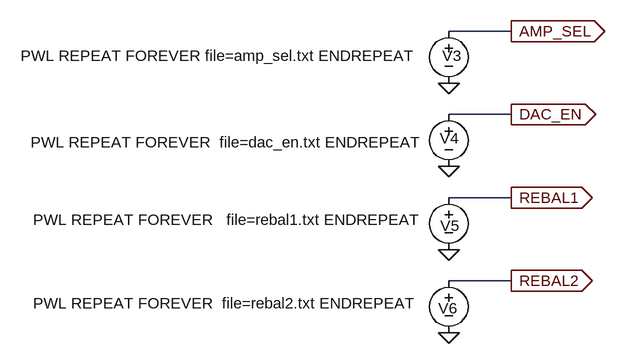
[diagram p0: schematic Python_Signal_Generator.asc]
Python_Signal_Generator.asc, the LTspice schematic file:
Version 4
SHEET 1 880 996
WIRE 176 256 80 256
WIRE 176 384 80 384
WIRE 176 512 80 512
WIRE 176 640 80 640
FLAG 80 336 0
FLAG 176 256 AMP_SEL
IOPIN 176 256 Out
FLAG 176 384 DAC_EN
IOPIN 176 384 Out
FLAG 176 512 REBAL1
IOPIN 176 512 Out
FLAG 176 640 REBAL2
IOPIN 176 640 Out
FLAG 80 464 0
FLAG 80 592 0
FLAG 80 720 0
SYMBOL voltage 80 240 R0
WINDOW 0 -10 54 Left 2
WINDOW 3 -659 54 Left 2
SYMATTR InstName V3
SYMATTR Value PWL REPEAT FOREVER file=amp_sel.txt ENDREPEAT
SYMBOL voltage 80 368 R0
WINDOW 0 -14 53 Left 2
WINDOW 3 -644 59 Left 2
SYMATTR InstName V4
SYMATTR Value PWL REPEAT FOREVER  file=dac_en.txt ENDREPEAT
SYMBOL voltage 80 496 R0
WINDOW 0 2 44 Top 2
WINDOW 3 -343 66 Bottom 2
SYMATTR InstName V5
SYMATTR Value PWL REPEAT FOREVER   file=rebal1.txt ENDREPEAT
SYMBOL voltage 80 624 R0
WINDOW 0 -1 43 Top 2
WINDOW 3 -347 66 Bottom 2
SYMATTR InstName V6
SYMATTR Value PWL REPEAT FOREVER  file=rebal2.txt ENDREPEAT

The netlist it stands for:
* Python_Signal_Generator.asc
V3 AMP_SEL 0 PWL REPEAT FOREVER file=amp_sel.txt ENDREPEAT
V4 DAC_EN 0 PWL REPEAT FOREVER  file=dac_en.txt ENDREPEAT
V5 REBAL1 0 PWL REPEAT FOREVER   file=rebal1.txt ENDREPEAT
V6 REBAL2 0 PWL REPEAT FOREVER  file=rebal2.txt ENDREPEAT
.backanno
.end